# Altium project Carrier-Board-v1.0.PrjPcb (part 8 of 15)

## Sheet ETHERNET_PHY1.SchDoc
size 420 x 297 mm; SheetNumber: 14; SheetTotal: 27
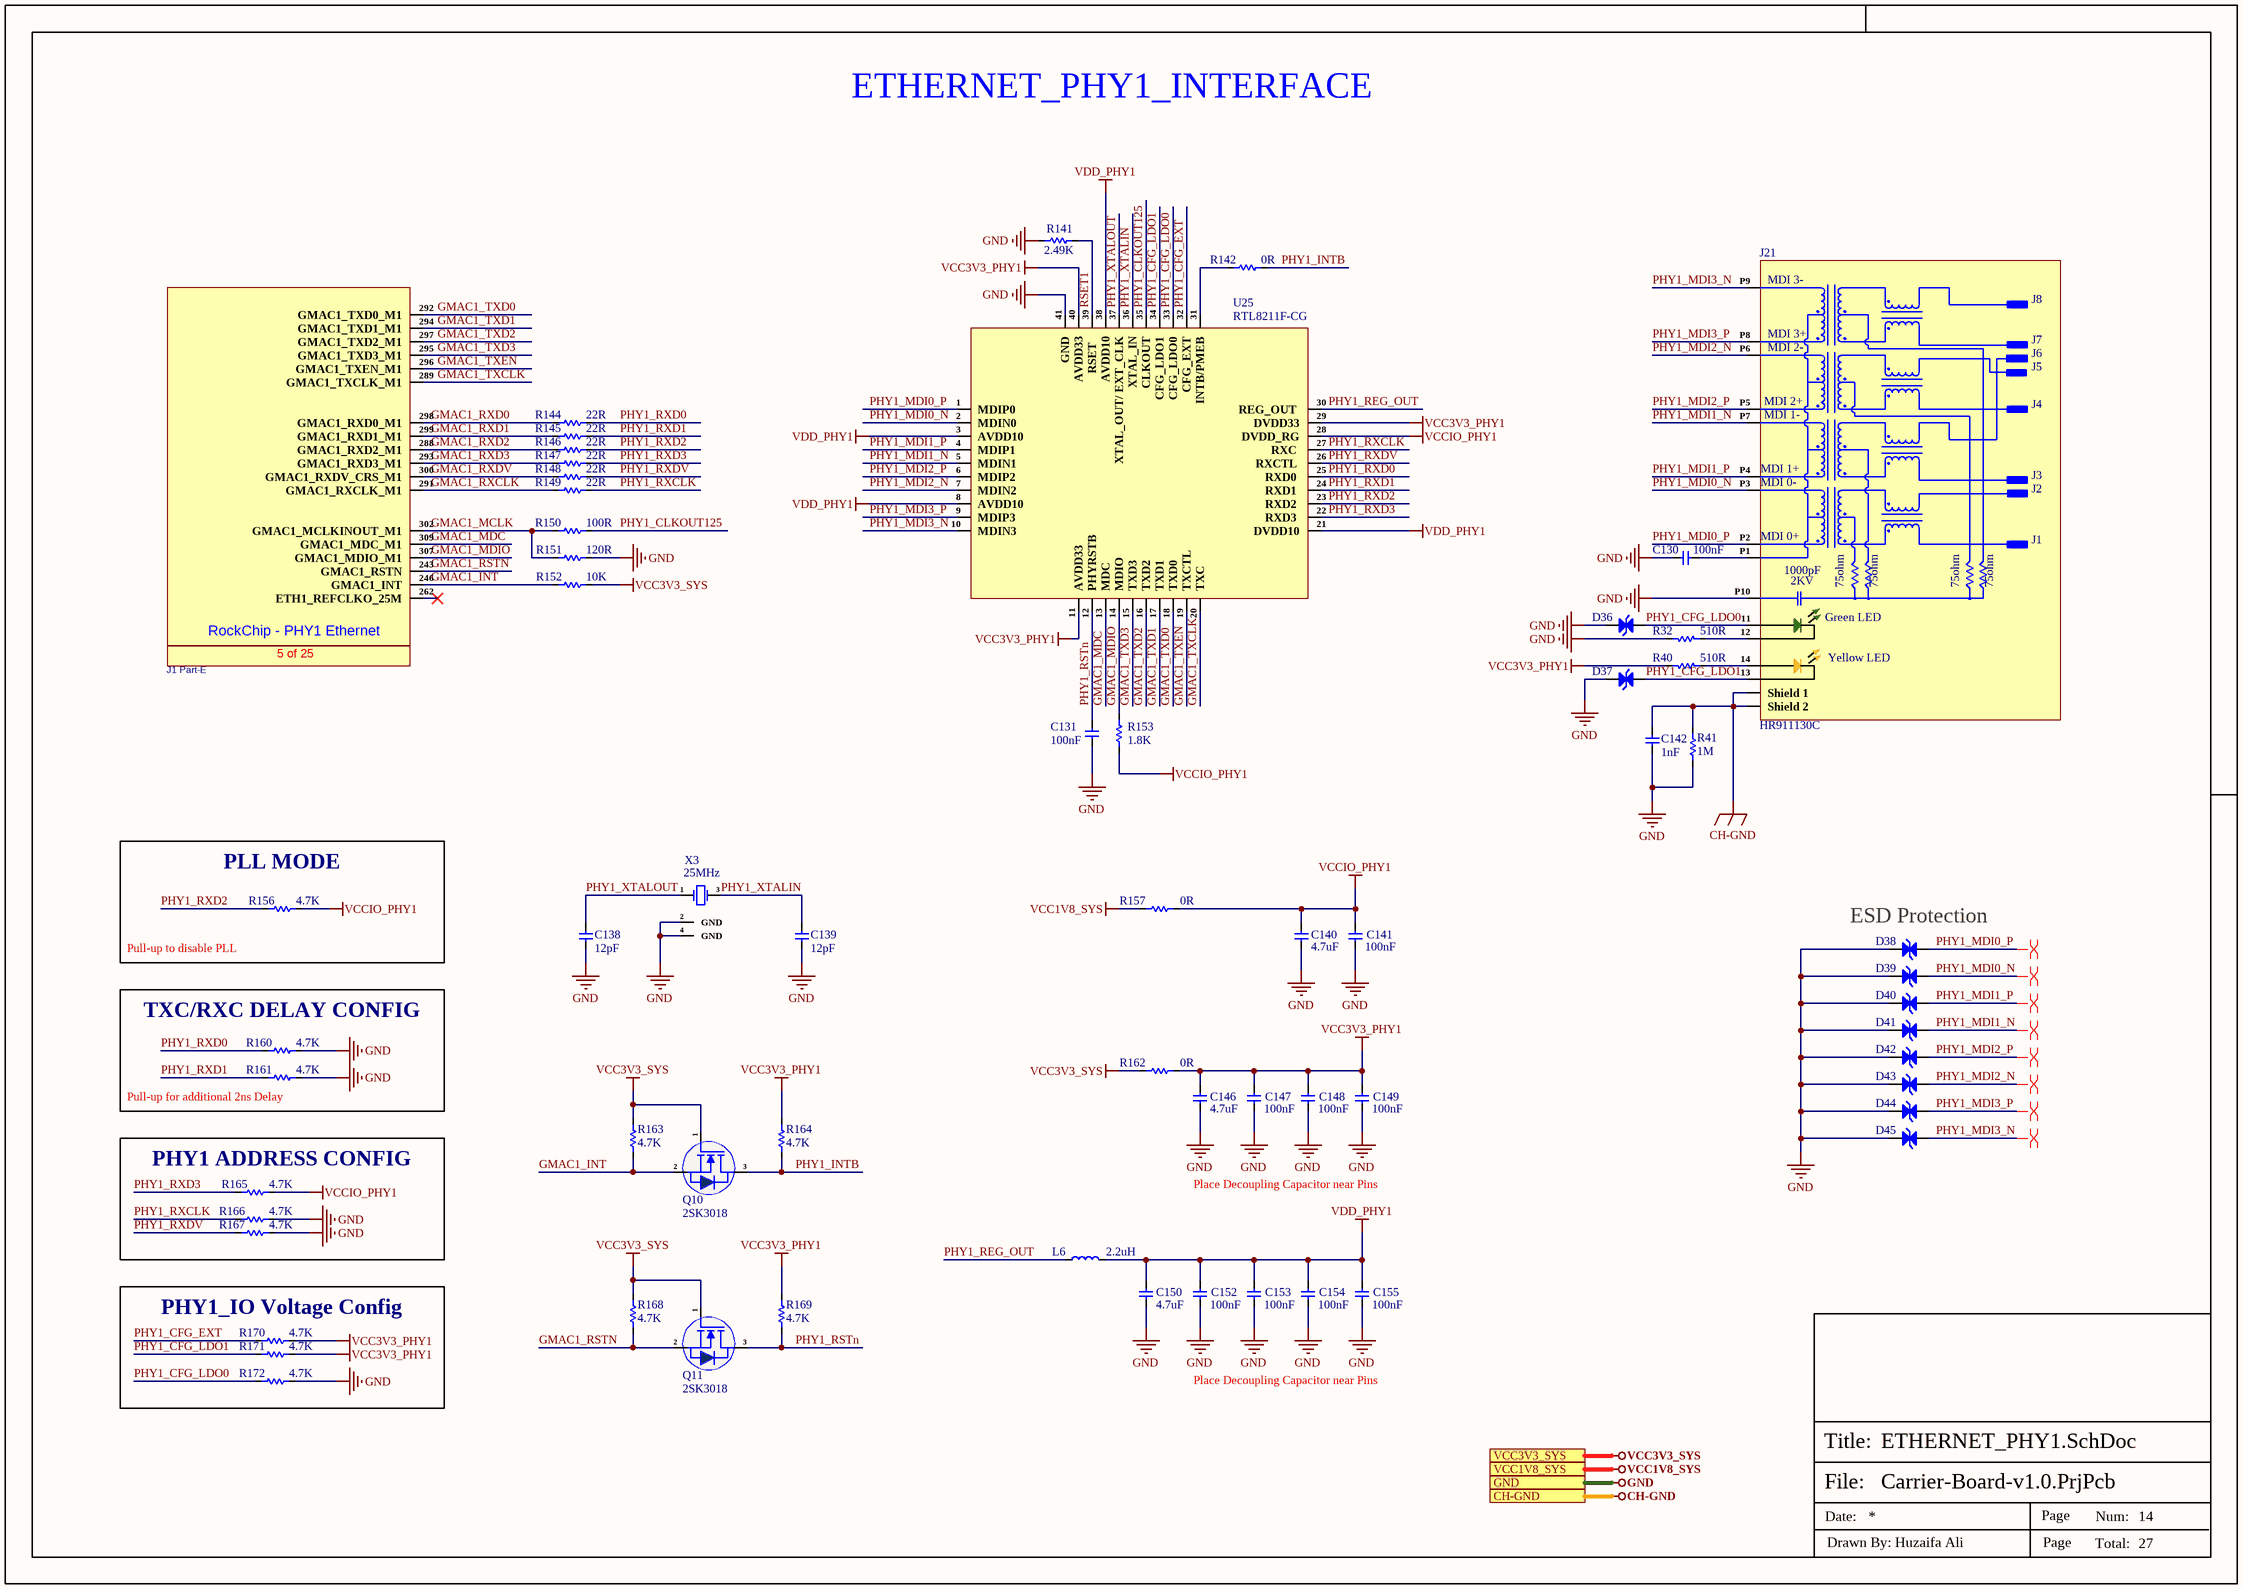
[diagram p13: ETHERNET_PHY1.SchDoc]

### Parts
C130  100nF  [cap-0402]
C131  100nF  [Cap-0402]
C138  12pF  [Cap-0402]
C139  12pF  [Cap-0402]
C140  4.7uF  [Cap-0402]
C141  100nF  [Cap-0402]
C142  1nF  [Cap-1206]
C146  4.7uF  [Cap-0402]
C147  100nF  [Cap-0402]
C148  100nF  [Cap-0402]
C149  100nF  [Cap-0402]
C150  4.7uF  [Cap-0402]
C152  100nF  [Cap-0402]
C153  100nF  [Cap-0402]
C154  100nF  [Cap-0402]
C155  100nF  [Cap-0402]
D36  ESD9X5VU  [DFN1006-2L_]  (value not drawn)
D37  ESD9X5VU  [DFN1006-2L_]  (value not drawn)
D38  ESD9X5VU  [DFN1006-2L_]  (value not drawn)
D39  ESD9X5VU  [DFN1006-2L_]  (value not drawn)
D40  ESD9X5VU  [DFN1006-2L_]  (value not drawn)
D41  ESD9X5VU  [DFN1006-2L_]  (value not drawn)
D42  ESD9X5VU  [DFN1006-2L_]  (value not drawn)
D43  ESD9X5VU  [DFN1006-2L_]  (value not drawn)
D44  ESD9X5VU  [DFN1006-2L_]  (value not drawn)
D45  ESD9X5VU  [DFN1006-2L_]  (value not drawn)
J1_Part-  AS0B826-S78B-7H  [AS0B826-S78B-7H]  (value not drawn)  (part E of 25)
J21  HR911130C  [HR911130C]
L6  2.2uH  [MAKK2016T2R2M_]
Q10  2SK3018  [SOT-23]
Q11  2SK3018  [SOT-23]
R32  510R  [Res-0402]
R40  510R  [Res-0402]
R41  1M  [Res-0402]
R141  2.49K  [Res-0402]
R142  0R  [Res-0402]
R144  22R  [Res-0402]
R145  22R  [Res-0402]
R146  22R  [Res-0402]
R147  22R  [Res-0402]
R148  22R  [Res-0402]
R149  22R  [Res-0402]
R150  100R  [Res-0402]
R151  120R  [Res-0402]
R152  10K  [Res-0402]
R153  1.8K  [Res-0402]
R156  4.7K  [Res-0402]
R157  0R  [Res-0603]
R160  4.7K  [Res-0402]
R161  4.7K  [Res-0402]
R162  0R  [Res-0603]
R163  4.7K  [Res-0402]
R164  4.7K  [Res-0402]
R165  4.7K  [Res-0402]
R166  4.7K  [Res-0402]
R167  4.7K  [Res-0402]
R168  4.7K  [Res-0402]
R169  4.7K  [Res-0402]
R170  4.7K  [Res-0402]
R171  4.7K  [Res-0402]
R172  4.7K  [Res-0402]
U25  RTL8211F-CG  [WQFN-40-EP(5x5)]
X3  25MHz  [Q22FA12800090]

### Blocks framed on the sheet
PLL MODE: R156
TXC/RXC DELAY CONFIG: R160 R161
PHY1 ADDRESS CONFIG: R165-R167
PHY1_IO Voltage Config: R170-R172

### Ports
CH-GND (see TOP SHEET[3B], ETHERNET_PHY0[4D], HDMI_INTERFACE[3D], MICRO_SD_INTERFACE[3D], USB2.0_INTERFACE[3D], USB3.0_INTERFACE[3D], USB-C_INTERFACE[2D]), GND (see TOP SHEET[3B], AUDIO_INTERFACE[1D], BUCK REGULATOR[3D], DEBUG_UART_INTERFACE[3D], DIGITAL IO_RELAY_SHEET[5D], DUAL_SIM_INTERFACE[3D], ETHERNET_PHY0[4D], GSM_INTERFACE[2D], HDMI_INTERFACE[3D], INPUT_PROTECTION[3D], LINEAR_VOLTAGE_REG[3D], MICRO_SD_INTERFACE[3D], MIPI-DSI DISPLAY[3D], POWER SECTION[3D], PUSH BUTTONs_INTERFACE[3C], RGB_LEDs_INTERFACE[3D], ROCKCHIP_PWR_SUPPLY[1D], ROCKCHIP_SYSTEM_CONTROL[3C], RS232_RS485_INTERFACE[3C], SENSOR_SHEET[3D], USB2.0_INTERFACE[3D], USB3.0_INTERFACE[3D], USB-C_INTERFACE[2D], WIEGAND_INTERFACE[3D], WIFI_BLUETOOTH_SHEET[4C]), VCC1V8_SYS (see TOP SHEET[3B], ETHERNET_PHY0[4D], LINEAR_VOLTAGE_REG[3D], POWER SECTION[3D], ROCKCHIP_PWR_SUPPLY[1D], WIFI_BLUETOOTH_SHEET[4C]), VCC3V3_SYS (see TOP SHEET[3B], AUDIO_INTERFACE[1D], BUCK REGULATOR[3D], DEBUG_UART_INTERFACE[3D], DIGITAL IO_RELAY_SHEET[5D], ETHERNET_PHY0[4D], GSM_INTERFACE[2D], HDMI_INTERFACE[3D], LINEAR_VOLTAGE_REG[3D], MIPI-DSI DISPLAY[3D], POWER SECTION[3D], PUSH BUTTONs_INTERFACE[3C], ROCKCHIP_PWR_SUPPLY[1D], ROCKCHIP_SYSTEM_CONTROL[3C], RS232_RS485_INTERFACE[3C], SENSOR_SHEET[3D], USB-C_INTERFACE[2D], WIEGAND_INTERFACE[3D], WIFI_BLUETOOTH_SHEET[4C])

### Nets
CH-GND: C142.2 J21.SH1(Shield_1) J21.SH2(Shield_2) R41.2 ; port CH-GND
GND: C130.1 C131.1 C138.1 C139.1 C140.1 C141.1 C142.1 C146.1 C147.1 C148.1 C149.1 C150.1 C152.1 C153.1 C154.1 C155.1 D36.1(A) D37.1(A) D38.1(A) D39.1(A) D40.1(A) D41.1(A) D42.1(A) D43.1(A) D44.1(A) D45.1(A) J21.P10 R32.2 R41.1 R141.1 R151.1 R160.2 R161.2 R166.2 R167.2 R172.2 U25.41(GND) X3.2(GND) X3.4(GND) ; port GND
VCC1V8_SYS: R157.1 ; port VCC1V8_SYS
VCC3V3_PHY1: C146.2 C147.2 C148.2 C149.2 R40.1 R162.2 R164.2 R169.2 R170.2 R171.2 U25.11(AVDD33) U25.29(DVDD33) U25.40(AVDD33)
VCC3V3_SYS: Q10.1(G) Q11.1(G) R152.1 R162.1 R163.2 R168.2 ; port VCC3V3_SYS
VCCIO_PHY1: C140.2 C141.2 R153.2 R156.2 R157.2 R165.2 U25.28(DVDD_RG)
VDD_PHY1: C150.2 C152.2 C153.2 C154.2 C155.2 L6.2 U25.3(AVDD10) U25.8(AVDD10) U25.21(DVDD10) U25.38(AVDD10)
GMAC1_INT: J1_Part-.246(GMAC1_INT) Q10.2(S) R152.2 R163.1
GMAC1_MCLK: J1_Part-.302(GMAC1_MCLKINOUT_M1) R150.1 R151.2
GMAC1_MDC: J1_Part-.309(GMAC1_MDC_M1) U25.13(MDC)
GMAC1_MDIO: J1_Part-.307(GMAC1_MDIO_M1) R153.1 U25.14(MDIO)
GMAC1_RSTN: J1_Part-.243(GMAC1_RSTN) Q11.2(S) R168.1
GMAC1_RXCLK: J1_Part-.291(GMAC1_RXCLK_M1) R149.1
GMAC1_RXD0: J1_Part-.298(GMAC1_RXD0_M1) R144.1
GMAC1_RXD1: J1_Part-.299(GMAC1_RXD1_M1) R145.1
GMAC1_RXD2: J1_Part-.288(GMAC1_RXD2_M1) R146.1
GMAC1_RXD3: J1_Part-.293(GMAC1_RXD3_M1) R147.1
GMAC1_RXDV: J1_Part-.300(GMAC1_RXDV_CRS_M1) R148.1
GMAC1_TXCLK: J1_Part-.289(GMAC1_TXCLK_M1) U25.20(TXC)
GMAC1_TXD0: J1_Part-.292(GMAC1_TXD0_M1) U25.18(TXD0)
GMAC1_TXD1: J1_Part-.294(GMAC1_TXD1_M1) U25.17(TXD1)
GMAC1_TXD2: J1_Part-.297(GMAC1_TXD2_M1) U25.16(TXD2)
GMAC1_TXD3: J1_Part-.295(GMAC1_TXD3_M1) U25.15(TXD3)
GMAC1_TXEN: J1_Part-.296(GMAC1_TXEN_M1) U25.19(TXCTL)
PHY1_CFG_EXT: R170.1 U25.32(CFG_EXT)
PHY1_CFG_LDO0: D36.2(A) J21.11 R172.1 U25.33(CFG_LDO0)
PHY1_CFG_LDO1: D37.2(A) J21.13 R171.1 U25.34(CFG_LDO1)
PHY1_CLKOUT125: R150.2 U25.35(CLKOUT)
PHY1_INTB: Q10.3(D) R142.2 R164.1
PHY1_MDI0_N: D39.2(A) J21.P3(P4) U25.2(MDIN0)
PHY1_MDI0_P: D38.2(A) J21.P2 U25.1(MDIP0)
PHY1_MDI1_N: D41.2(A) J21.P7 U25.5(MDIN1)
PHY1_MDI1_P: D40.2(A) J21.P4 U25.4(MDIP1)
PHY1_MDI2_N: D43.2(A) J21.P6 U25.7(MDIN2)
PHY1_MDI2_P: D42.2(A) J21.P5 U25.6(MDIP2)
PHY1_MDI3_N: D45.2(A) J21.P9 U25.10(MDIN3)
PHY1_MDI3_P: D44.2(A) J21.P8 U25.9(MDIP3)
PHY1_REG_OUT: L6.1 U25.30(REG_OUT)
PHY1_RSTn: C131.2 Q11.3(D) R169.1 U25.12(PHYRSTB)
PHY1_RXCLK: R149.2 R166.1 U25.27(RXC)
PHY1_RXD0: R144.2 R160.1 U25.25(RXD0)
PHY1_RXD1: R145.2 R161.1 U25.24(RXD1)
PHY1_RXD2: R146.2 R156.1 U25.23(RXD2)
PHY1_RXD3: R147.2 R165.1 U25.22(RXD3)
PHY1_RXDV: R148.2 R167.1 U25.26(RXCTL)
PHY1_XTALIN: C139.2 U25.36(XTAL_IN) X3.3(OSC2)
PHY1_XTALOUT: C138.2 U25.37(XTAL_OUT/_EXT_CLK) X3.1(OSC1)
RSET1: R141.2 U25.39(RSET)
NetC130_2: C130.2 J21.P1
NetJ21_12: J21.12 R32.1
NetJ21_14: J21.14 R40.2
NetR142_1: R142.1 U25.31(INTB/PMEB)

Not connected (* = marked no-connect by the designer): J1_Part- 262(ETH1_REFCLKO_25M)*

### Layout directives
differential pair; differential pair class DIFF-ETH-100; rule Impedance Constraint [Min = 100.0    Max = 110.0    ]; rule Matched Net Lengths [Tolerance = 0.508mm]: PHY1_MDI0_N, PHY1_MDI0_P, PHY1_MDI1_N, PHY1_MDI1_P, PHY1_MDI2_N, PHY1_MDI2_P, PHY1_MDI3_N, PHY1_MDI3_P

### Notes on the sheet
- ETHERNET_PHY1_INTERFACE
- (near D38) ESD Protection
- (near R156) Pull-up to disable PLL
- (near R161) Pull-up for additional 2ns Delay
- Place Decoupling Capacitor near Pins
- File:
- Title:
- Date:
- Page
- Num:
- Total:
- Drawn By: Huzaifa Ali
- (in symbol AS0B826-S78B-7H, part E) RockChip - PHY1 Ethernet; 5 of 25
- (in symbol HR911130C) MDI 3-; J8; MDI 3+; J7; MDI 2-; J6; J5; MDI 2+; J4; MDI 1-; MDI 1+; J3; MDI 0-; J2; MDI 0+; J1; 1000pF; 2KV; 75ohm; Green LED; Yellow LED

### Library data of the parts
C130 = C1005X7R1H104KT000F: CAP CER 0.1UF 50V X7R 0402; Manufacturer: TDK; Tolerance: 10%; Voltage: 25V; Item Type: Capacitor; Supplier 1: Avnet; Manufacturer Part Number: C1005X7R1H104KT000F; RoHS: No; Category: Ceramic Capacitors; Dielectric: X7R; ComponentLink1URL: https://www.lcsc.com/product-detail/Multilayer-Ceramic-Capacitors-MLCC-SMD-SMT_TDK-C1005X7R1H104KT000F_C361198.html; ComponentLink1Description: LCSC; Supplier Part Number 1: C1005X7R1H104KT000F; LCSC Part Number: C361198
C131 C141 C147-C149 C152-C155 = CC0402KRX5R7BB104: CAP CER 0.1UF 16V X5R 0402; Manufacturer: Yageo; Tolerance: 10%; Supplier 1: Mouser; Manufacturer Part Number: CC0402KRX5R7BB104; RoHS: Yes; Category: Ceramic Capacitors; Stock 1: 936792; Pricing 1: 1=0.10000, 10=0.02300, 50=0.02300, 100=0.01100, 1000=0.00600, 10000=0.00400 (USD); Mount: Surface Mount; Case/Package: 0402; Case Code (Imperial): 0402; Case Code (Metric): 1005; Min Operating Temperature: -55°C; Max Operating Temperature: 85°C; Capacitance: 100nF; Packaging: Tape and Reel; Voltage Rating: 16V; Dielectric: X5R; Termination: SMD/SMT; Voltage Rating (DC): 16V; Package Quantity: 1; Length: 1mm; Width: 0.02inch; Thickness: 0.022inch; Lead Free: Lead Free; Halogen Free: Halogen Free; ComponentLink1URL: https://datasheet.ciiva.com/155/mlccorderingcode-155879.pdf?src-supplier=Digi-Key; ComponentLink1Description: https://datasheet.ciiva.com/155/mlccorderingcode-155879.pdf?src-supplier=Digi-Key; ComponentLink2URL: https://datasheet.ciiva.com/155/mlccorderingcode-155878.pdf?src-supplier=Digi-Key; ComponentLink2Description: https://datasheet.ciiva.com/155/mlccorderingcode-155878.pdf?src-supplier=Digi-Key; ComponentLink3URL: https://datasheet.ciiva.com/155/mlccorderingcode-155880.pdf?src-supplier=Digi-Key; ComponentLink3Description: https://datasheet.ciiva.com/155/mlccorderingcode-155880.pdf?src-supplier=Digi-Key; Supplier Part Number 1: 603-CC402KRX5R7BB104; LCSC Part Number: C106204; Number of Pins: 2; Resistor Type: Ceramic; Series: CC; Construction: Flat; Height: 0.5mm; Depth: 0.5mm; Radiation Hardening: No; REACH SVHC: Unknown; RoHS Compliant: Yes; ComponentLink4URL: https://datasheet.ciiva.com/11464/upy-gphc-x5r-4v-to-50v-12-11464869.pdf?src-supplier=Avnet; ComponentLink4Description: https://datasheet.ciiva.com/11464/upy-gphc-x5r-4v-to-50v-12-11464869.pdf?src-supplier=Avnet
C138 C139 = GJM1555C1H120GB01D: CAP CER 12PF 50V C0G/NP0 0402; Manufacturer: Murata; Tolerance: 2%; Dielectric: C0G; Supplier 1: Digi-Key; Manufacturer Part Number: GJM1555C1H120GB01D; RoHS: Yes; Category: Ceramic Capacitors; Stock 1: 266975; Pricing 1: 1=0.18000, 10=0.12600, 50=0.07560, 100=0.06390, 500=0.04370, 1000=0.03865, 2500=0.03698, 5000=0.03361 (USD); Mount: Surface Mount; Case/Package: 0402; Case Code (Imperial): 0402; Case Code (Metric): 1005; Min Operating Temperature: -55°C; Max Operating Temperature: 125°C; Capacitance: 12pF; Voltage Rating: 50V; Voltage Rating (DC): 50V; Packaging: Tape and Reel; Package Quantity: 10000; Termination: SMD/SMT; Series: GJM; Construction: Flat; Length: 1mm; Width: 0.5mm; Height: 0.5mm; Thickness: 0.022inch; Depth: 0.5mm; Radiation Hardening: No; Lead Free: Lead Free; RoHS Compliant: Yes; ComponentLink1URL: https://datasheet.ciiva.com/11608/product-11608208.pdf?src-supplier=Avnet; ComponentLink1Description: https://datasheet.ciiva.com/11608/product-11608208.pdf?src-supplier=Avnet; ComponentLink2URL: https://datasheet.ciiva.com/29542/partnumbering-e-01-29542716.pdf?src-supplier=Digi-Key; ComponentLink2Description: https://datasheet.ciiva.com/29542/partnumbering-e-01-29542716.pdf?src-supplier=Digi-Key; ComponentLink3URL: https://datasheet.ciiva.com/29542/partnumbering-e-01-29542715.pdf?src-supplier=Digi-Key; ComponentLink3Description: https://datasheet.ciiva.com/29542/partnumbering-e-01-29542715.pdf?src-supplier=Digi-Key; ComponentLink4URL: https://datasheet.ciiva.com/29542/partnumbering-e-01-29542717.pdf?src-supplier=Digi-Key; ComponentLink4Description: https://datasheet.ciiva.com/29542/partnumbering-e-01-29542717.pdf?src-supplier=Digi-Key; Supplier Part Number 1: 490-8078-1-ND; LCSC Part Number: C161305
C140 C146 C150 = CC0402KRX5R6BB475: CAP CER 4.7UF 10V X5R 0402; Manufacturer: Yageo; Tolerance: 10%; Supplier 1: Farnell; Manufacturer Part Number: CC0402KRX5R6BB475; RoHS: Yes; Category: Ceramic Capacitors; Stock 1: 20000; Pricing 1: 10000=0.02310, 50000=0.02100 (GBP); Mount: Surface Mount; Case/Package: 0402; Case Code (Imperial): 0402; Case Code (Metric): 1005; Min Operating Temperature: -55°C; Max Operating Temperature: 85°C; Packaging: Cut Tape; Capacitance: 4.7uF; Voltage Rating: 10V; RoHS Compliant: Yes; ComponentLink1URL: http://www.yageo.com/documents/recent/UPY-GPHC_X5R_4V-to-50V_25.pdf?src-supplier=Digi-Key; ComponentLink1Description: http://www.yageo.com/documents/recent/UPY-GPHC_X5R_4V-to-50V_25.pdf?src-supplier=Digi-Key; Supplier Part Number 1: 3871698; LCSC Part Number: C326586
C142 = CC1206KKX7RDBB102: CAP CER 1000PF 2KV X7R 1206; Manufacturer: Yageo; Tolerance: 10%; Dissipation Factor: 2.5%; Insulation Resistance: 10GR; Item Type: Capacitor; Manufacturer Part Number: CC1206KKX7RDBB102; RoHS: Yes; Category: Ceramic Capacitors; Case/Package: 1206; Case Code (Metric): 3216; Case Code (Imperial): 1206; Min Operating Temperature: -55°C; Max Operating Temperature: 125°C; Voltage Rating: 2kV; Packaging: Tape and Reel; Dielectric: X7R; Termination: SMD/SMT; Voltage Rating (DC): 2kV; Series: CC; Construction: Flat; Length: 3.2mm; RoHS Compliant: Yes; ComponentLink1URL: https://datasheet.ciiva.com/23942/1449957-23942422.pdf?src-supplier=Newark; ComponentLink1Description: https://datasheet.ciiva.com/23942/1449957-23942422.pdf?src-supplier=Newark; ComponentLink2URL: https://datasheet.ciiva.com/186/upy-np0x7r-hv-1kv-to-3kv-4-186736.pdf?src-supplier=Digi-Key; ComponentLink2Description: https://datasheet.ciiva.com/186/upy-np0x7r-hv-1kv-to-3kv-4-186736.pdf?src-supplier=Digi-Key; ComponentLink3URL: https://datasheet.ciiva.com/186/upy-np0x7r-hv-1kv-to-3kv-4-186737.pdf?src-supplier=Digi-Key; ComponentLink3Description: https://datasheet.ciiva.com/186/upy-np0x7r-hv-1kv-to-3kv-4-186737.pdf?src-supplier=Digi-Key; ComponentLink4URL: https://datasheet.ciiva.com/13386/upy-gp-np0-16v-to-50v-8-13386312.pdf?src-supplier=Mouser; ComponentLink4Description: https://datasheet.ciiva.com/13386/upy-gp-np0-16v-to-50v-8-13386312.pdf?src-supplier=Mouser; ComponentLink5URL: https://datasheet.ciiva.com/186/upy-np0x7r-hv-1kv-to-3kv-4-186735.pdf?src-supplier=Digi-Key; ComponentLink5Description: https://datasheet.ciiva.com/186/upy-np0x7r-hv-1kv-to-3kv-4-186735.pdf?src-supplier=Digi-Key; Supplier 1: Digi-Key; Stock 1: 19260; Pricing 1: 1=0.35000, 10=0.24000, 50=0.16780, 100=0.14390, 500=0.10794, 1000=0.09114 (USD); Mount: Surface Mount; Number of Pins: 2; Capacitance: 1nF; Voltage: 2kV; Package Quantity: 1; Resistor Type: Ceramic; Width: 0.063inch; Height: 1.25mm; Depth: 1.6mm; Thickness: 0.057inch; Radiation Hardening: No; REACH SVHC: Unknown; Lead Free: Lead Free; Supplier Part Number 1: 311-1487-1-ND; LCSC Part Number: C23631
D36-D45 = ESD9X5VU: DFN1006-2 ESD Protection Devices ROHS; Manufacturer: TECH PUBLIC; Manufacturer Part Number: ESD9X5VU; Footprint: DFN1006-2; ComponentLink1Description: LCSC; ComponentLink1URL: https://www.lcsc.com/product-detail/span-style-background-color-ff0-ESD-span-Protection-Devices_TECH-PUBLIC-ESD9X5VU_C2875160.html; LCSC Part Number: C2875160
J1_Part- = AS0B826-S78B-7H: SMD,P=0.5mm,Surface Mount，Right Angle; Manufacturer: FOXCONN; Item Type: Card Edge Connectors; Supplier: LCSC; Manufacturer Part Number: AS0B826-S78B-7H; RoHS: No; Stock: 4979; Pricing: 1=9.21, 10=8.287, 25=7.8064, 50=7.6064, 100=7.4062 (USD); LCSC Part Number: C426232
J21 = HR911130C: RJ45 RJReceptacle 1 Internal oscillator included Shrouded WithLED Plugin Ethernet Connectors/Modular Connectors (RJ45 RJ11) ROHS; Manufacturer: HANRUN; Manufacturer Part Number: HR911130C; LCSC Part Number: C50933; Item Type: Ethernet Connector; ComponentLink1Description: LCSC; ComponentLink1URL: https://www.lcsc.com/product-detail/Ethernet-Connectors-Modular-Connectors-RJ45-RJ11_HANRUN-Zhongshan-HanRun-Elec-HR911130C_C50933.html
L6 = MAKK2016T2R2M: FIXED IND 2.2UH 1.5A 160MOHM SMD; Manufacturer: Taiyo Yuden; Core Material: Metal; Tolerance: 20%; Shielding: Shielded; DC Resistance (DCR): 160mR; Test Frequency: 2MHz; Item Type: Inductor; Supplier 1: Mouser; Manufacturer Part Number: MAKK2016T2R2M; RoHS: Yes; Category: Fixed Inductors; Stock 1: 64320; Pricing 1: 1=0.27000, 10=0.17200, 50=0.17200, 100=0.14000, 1000=0.10600, 10000=0.09200 (USD); Mount: Surface Mount; Case/Package: 0806; Case Code (Metric): 2016; Case Code (Imperial): 0806; Min Operating Temperature: -40°C; Max Operating Temperature: 105°C; Packaging: Tape and Reel; Package Quantity: 3000; Resistor Type: Wirewound; Inductance: 2.2uH; Current Rating: 1.5A; Saturation Current: 1.5A; Max DC Current: 1.5A; Termination: SMD/SMT; Length: 0.079inch; Width: 0.063inch; Height: 1mm; Height - Seated (Max): 0.039inch; Depth: 1.6mm; Radiation Hardening: No; Halogen Free: Halogen Free; RoHS Compliant: Yes; ComponentLink1URL: https://datasheet.ciiva.com/30014/makk2016t2r2m-ss-30014449.pdf?src-supplier=Avnet; ComponentLink1Description: https://datasheet.ciiva.com/30014/makk2016t2r2m-ss-30014449.pdf?src-supplier=Avnet; Supplier Part Number 1: 963-MAKK2016T2R2M; LCSC Part Number: C92923
Q10 Q11 = 2SK3018: 30V 100mA 200mW 8Ω@4V,10mA N Channel SOT-23 MOSFETs ROHS; Manufacturer: KUU; Item Type: MOSFET; Manufacturer Part Number: 2SK3018; Package: SOT-23; LCSC Part Number: C2944164; ComponentLink1Description: LCSC; ComponentLink1URL: https://www.lcsc.com/product-detail/MOSFETs_KUU-2SK3018_C2944164.html
R32 R40 = RT0402FRE07510RL: RES SMD 510 OHM 1% 1/16W 0402; Manufacturer: Yageo; Max Power Dissipation: 63mW; Temperature Coefficient: 50ppm/°C; Voltage Rating (DC): 50V; Item Type: Resistor; Supplier: Digikey; Supplier Part Number: 13-RT0402FRE07510RLCT-ND; Manufacturer Part Number: RT0402FRE07510RL; RoHS: Yes; Category: Chip SMD Resistors; Stock: 19529; Pricing: 1=0.1, 10=0.027, 50=0.0224, 100=0.0203, 500=0.0161, 1000=0.01443, 5000=0.01101 (USD); Case/Package: 0402; Min Operating Temperature: -55°C; Max Operating Temperature: 125°C; Package Quantity: 10000; Packaging: Tape and Reel; Value: 510R; Tolerance: 1%; Number of Terminations: 2; Series: RT; Length: 0.039inch; Width: 0.02inch; Height: 0.014inch; Lead Free: Lead Free; RoHS Compliant: Yes; ComponentLink1URL: https://datasheet.ciiva.com/2561/pyu-rt-1-to-0-05-rohs-l-5-2561767.pdf?src-supplier=Digikey; ComponentLink1Description: https://datasheet.ciiva.com/2561/pyu-rt-1-to-0-05-rohs-l-5-2561767.pdf?src-supplier=Digikey; LCSC Part Number: C854355
R41 = AF0402JR-071ML: RES SMD 1M OHM 5% 1/16W 0402; Manufacturer: Yageo; Temperature Coefficient: 100ppm/°C; Resistance: 1MR; Item Type: Resistor; Max Power Dissipation: 63mW; Manufacturer Part Number: AF0402JR-071ML; Case/Package: 0402; Min Operating Temperature: -55°C; Max Operating Temperature: 155°C; Packaging: Tape and Reel; Tolerance: 5%; Height: 0.015inch; ComponentLink1URL: https://www.yageo.com/upload/media/product/productsearch/datasheet/rchip/PYu-AF_51_RoHS_L_6.pdf?src-supplier=Digi-Key; ComponentLink1Description: https://www.yageo.com/upload/media/product/productsearch/datasheet/rchip/PYu-AF_51_RoHS_L_6.pdf?src-supplier=Digi-Key; Supplier 1: Digi-Key; Stock 1: 0; Pricing 1: 10000=0.00408 (USD); Length: 0.039inch; Width: 0.02inch; Supplier Part Number 1: AF0402JR-071ML-ND; LCSC Part Number: C144054; Resistor Type: Thick Film; Number of Terminations: 2; Features: Moisture Resistant,Anti-Sulfur; RoHS Compliant: Yes
R141 = RC0402FR-072K49L: RES 2.49K OHM 1% 1/16W 0402; Manufacturer: Yageo; Power Rating: 62.5mW; Temperature Coefficient: 100ppm/°C; Value: 2.49kR; Voltage Rating: 50V; Max Power Dissipation: 63mW; Item Type: Resistors; Manufacturer Part Number: RC0402FR-072K49L; RoHS: Yes; Case Code (Imperial): 0402; Case Code (Metric): 1005; Case/Package: 0402; Min Operating Temperature: -55°C; Max Operating Temperature: 155°C; Tolerance: 1%; Series: RC; Packaging: Tape and Reel; Termination: SMD/SMT; Resistor Type: Thick Film; Features: Moisture Resistant; Number of Terminations: 2; Resistance Tolerance: 1%; Voltage Rating (DC): 50V; Length: 0.039inch; Width: 0.02inch; Height: 0.016inch; RoHS Compliant: Yes; Reach SVHC Compliant: No; Lead Free: Lead Free; ComponentLink1URL: https://datasheet.ciiva.com/2518/pyu-r-int-thick-7-2518986.pdf?src-supplier=Digikey; ComponentLink1Description: https://datasheet.ciiva.com/2518/pyu-r-int-thick-7-2518986.pdf?src-supplier=Digikey; LCSC Part Number: C145071; Package Quantity: 1; ComponentLink2URL: https://datasheet.ciiva.com/2518/pyu-r-int-thick-7-2518987.pdf?src-supplier=Digikey; ComponentLink2Description: https://datasheet.ciiva.com/2518/pyu-r-int-thick-7-2518987.pdf?src-supplier=Digikey; ComponentLink3URL: https://datasheet.ciiva.com/7983/1018594-7983516.pdf?src-supplier=Element14; ComponentLink3Description: https://datasheet.ciiva.com/7983/1018594-7983516.pdf?src-supplier=Element14; ComponentLink4URL: https://datasheet.ciiva.com/2518/pyu-r-int-thick-7-2518985.pdf?src-supplier=Digikey; ComponentLink4Description: https://datasheet.ciiva.com/2518/pyu-r-int-thick-7-2518985.pdf?src-supplier=Digikey; ComponentLink5URL: https://datasheet.ciiva.com/5558/pyu-rc0402-51-rohs-l-6-r-5558122.pdf?src-supplier=Mouser; ComponentLink5Description: https://datasheet.ciiva.com/5558/pyu-rc0402-51-rohs-l-6-r-5558122.pdf?src-supplier=Mouser; Supplier: Future Electronics; Supplier Part Number: 7635139; Stock: 530000; Pricing: 10000=0.0012, 100000=0.0011, 300000=0.001, 750000=0.001, 2000000=0.0009 (USD); Contact Plating: Tin,Lead
R142 = RC0402FR-070RL: RES 0 OHM JUMPER 1/16W 0402; Manufacturer: Yageo; Power Rating: 62.5mW; Tolerance: 1%; Voltage Rating: 50V; Temperature Coefficient: 200ppm/°C; Max Power Dissipation: 63mW; Supplier 1: Mouser; Manufacturer Part Number: RC0402FR-070RL; RoHS: Yes; Category: Chip SMD Resistors; Stock 1: 8556842; Pricing 1: 1=0.10000, 10=0.01400, 50=0.01400, 100=0.00600, 1000=0.00300, 5000=0.00200, 10000=0.00100 (USD); Case/Package: 0402; Case Code (Imperial): 0402; Case Code (Metric): 1005; Size Code: 0402; Min Operating Temperature: -55°C; Max Operating Temperature: 155°C; Resistor Type: Thick Film; Resistance: 0R; Packaging: Tape and Reel; Termination: SMD/SMT; Features: Moisture Resistant; Series: RC; Number of Terminations: 2; Length: 1mm; Width: 0.5mm; Height: 0.35mm; RoHS Compliant: Yes; Lead Free: Lead Free; ComponentLink1URL: https://datasheet.ciiva.com/8896/pyu-rc0402-51-rohs-l-6-8896149.pdf?src-supplier=Avnet; ComponentLink1Description: https://datasheet.ciiva.com/8896/pyu-rc0402-51-rohs-l-6-8896149.pdf?src-supplier=Avnet; ComponentLink2URL: https://datasheet.ciiva.com/16790/pyu-rc0402-51-rohs-l-6-r-16790444.pdf?src-supplier=Future+Electronics; ComponentLink2Description: https://datasheet.ciiva.com/16790/pyu-rc0402-51-rohs-l-6-r-16790444.pdf?src-supplier=Future+Electronics; Supplier Part Number 1: 603-RC0402FR-070RL; LCSC Part Number: C106231; Mount: Surface Mount; Contact Plating: Tin,Matte; Radiation Hardening: No
R144-R149 = RC0402FR-0722RL: RES 22 OHM 1% 1/16W 0402; Manufacturer: Yageo; Voltage Rating: 50V; Power Rating: 62.5mW; Temperature Coefficient: 100ppm/°C; Max Power Dissipation: 63mW; Item Type: Resistor; Supplier 1: Avnet; Manufacturer Part Number: RC0402FR-0722RL; RoHS: Yes; Category: Chip SMD Resistors; Stock 1: 1810000; Pricing 1: 10000=0.00085 (USD); Case/Package: 0402; Number of Pins: 2; Case Code (Imperial): 0402; Case Code (Metric): 1005; Size Code: 0402; Min Operating Temperature: -55°C; Max Operating Temperature: 155°C; Resistor Type: Thick Film; Voltage Rating (DC): 50V; Resistance: 22R; Tolerance: 1%; Packaging: Tape and Reel; Termination: SMD/SMT; Features: Moisture Resistant; Series: RC; Number of Terminations: 2; Resistance Tolerance: 1%; Technology: THICK FILM; Construction: Rectangular; Length: 1mm; Width: 0.5mm; Height: 0.32mm; Depth: 0.5mm; RoHS Compliant: Yes; Reach SVHC Compliant: Yes; Military Standard: Not; Lead Free: Lead Free; ComponentLink1URL: https://datasheet.ciiva.com/11819/0900766b80c66297-11819462.pdf?src-supplier=RSComponents; ComponentLink1Description: https://datasheet.ciiva.com/11819/0900766b80c66297-11819462.pdf?src-supplier=RSComponents; ComponentLink2URL: https://datasheet.ciiva.com/7849/1018594-7849912.pdf?src-supplier=Element14; ComponentLink2Description: https://datasheet.ciiva.com/7849/1018594-7849912.pdf?src-supplier=Element14; ComponentLink3URL: https://datasheet.ciiva.com/7849/1018594-7849911.pdf?src-supplier=Element14; ComponentLink3Description: https://datasheet.ciiva.com/7849/1018594-7849911.pdf?src-supplier=Element14; ComponentLink4URL: https://datasheet.ciiva.com/16930/pyu-rc0402-51-rohs-l-6-r-16930687.pdf?src-supplier=Future+Electronics; ComponentLink4Description: https://datasheet.ciiva.com/16930/pyu-rc0402-51-rohs-l-6-r-16930687.pdf?src-supplier=Future+Electronics; ComponentLink5URL: https://datasheet.ciiva.com/26829/getdatasheetpartid-554995-26829991.pdf?src-supplier=Verical; ComponentLink5Description: https://datasheet.ciiva.com/26829/getdatasheetpartid-554995-26829991.pdf?src-supplier=Verical; Supplier Part Number 1: RC0402FR-0722RL; LCSC Part Number: C114765
R150 = RC0402FR-07100RL: RES 100 OHM 1% 1/16W 0402; Manufacturer: Yageo; Power Rating: 62.5mW; Voltage Rating: 50V; Temperature Coefficient: 100ppm/°C; Max Power Dissipation: 63mW; Item Type: Resistor; Supplier 1: Mouser; Manufacturer Part Number: RC0402FR-07100RL; RoHS: Yes; Category: Chip SMD Resistors; Stock 1: 699545; Pricing 1: 1=0.10000, 10=0.01200, 50=0.01200, 100=0.00500, 1000=0.00300, 2500=0.00200, 10000=0.00100 (USD); Case/Package: 0402; Number of Pins: 2; Case Code (Imperial): 0402; Case Code (Metric): 1005; Size Code: 0402; Min Operating Temperature: -55°C; Max Operating Temperature: 155°C; Tolerance: 1%; Voltage Rating (DC): 50V; Resistance: 100R; Packaging: Tape and Reel; Termination: SMD/SMT; Resistor Type: Thick Film; Features: Moisture Resistant; Series: RC; Number of Terminations: 2; Resistance Tolerance: 1%; Construction: Rectangular; Technology: THICK FILM; Length: 1mm; Width: 0.5mm; Height: 0.32mm; Depth: 0.5mm; RoHS Compliant: Yes; REACH SVHC: No SVHC; Military Standard: Not; Lead Free: Lead Free; ComponentLink1URL: https://datasheet.ciiva.com/11808/0900766b80c66297-11808765.pdf?src-supplier=RSComponents; ComponentLink1Description: https://datasheet.ciiva.com/11808/0900766b80c66297-11808765.pdf?src-supplier=RSComponents; ComponentLink2URL: https://datasheet.ciiva.com/7849/1784430-7849810.pdf?src-supplier=Element14; ComponentLink2Description: https://datasheet.ciiva.com/7849/1784430-7849810.pdf?src-supplier=Element14; ComponentLink3URL: https://datasheet.ciiva.com/28367/1018594-28367226.pdf?src-supplier=Element14; ComponentLink3Description: https://datasheet.ciiva.com/28367/1018594-28367226.pdf?src-supplier=Element14; ComponentLink4URL: https://datasheet.ciiva.com/22747/1018594-22747511.pdf?src-supplier=Element14; ComponentLink4Description: https://datasheet.ciiva.com/22747/1018594-22747511.pdf?src-supplier=Element14; ComponentLink5URL: https://datasheet.ciiva.com/12667/pyu-rc0402-51-rohs-l-6-r-12667957.pdf?src-supplier=Mouser; ComponentLink5Description: https://datasheet.ciiva.com/12667/pyu-rc0402-51-rohs-l-6-r-12667957.pdf?src-supplier=Mouser; ComponentLink6URL: https://datasheet.ciiva.com/15189/getdatasheetpartid-329466-15189335.pdf?src-supplier=Verical; ComponentLink6Description: https://datasheet.ciiva.com/15189/getdatasheetpartid-329466-15189335.pdf?src-supplier=Verical; ComponentLink7URL: https://datasheet.ciiva.com/16740/pyu-rc0402-51-rohs-l-6-r-16740566.pdf?src-supplier=Future+Electronics; ComponentLink7Description: https://datasheet.ciiva.com/16740/pyu-rc0402-51-rohs-l-6-r-16740566.pdf?src-supplier=Future+Electronics; Supplier Part Number 1: 603-RC0402FR-07100RL; LCSC Part Number: C106232
R151 = RC0402FR-07120RL: RES 120 OHM 1% 1/16W 0402; Manufacturer: Yageo; Temperature Coefficient: 100ppm/°C; Power Rating: 62.5mW; Voltage Rating: 50V; Max Power Dissipation: 63mW; Item Type: Resistors; Manufacturer Part Number: RC0402FR-07120RL; RoHS: Yes; Case/Package: 0402; Case Code (Metric): 1005; Case Code (Imperial): 0402; Min Operating Temperature: -55°C; Max Operating Temperature: 155°C; Tolerance: 1%; Resistor Type: Thick Film; Packaging: Tape and Reel; Package Quantity: 1; Number of Terminations: 2; Termination: SMD/SMT; Features: Moisture Resistant; Series: RC; Construction: Rectangular; Resistance Tolerance: 1%; Length: 0.039inch; Width: 0.02inch; Height: 0.016inch; Depth: 0.5mm; Lead Free: 5697LeadFree; Military Standard: Not; RoHS Compliant: Yes; ComponentLink1URL: https://datasheet.ciiva.com/12667/pyu-rc0402-51-rohs-l-6-r-12667958.pdf?src-supplier=Mouser; ComponentLink1Description: https://datasheet.ciiva.com/12667/pyu-rc0402-51-rohs-l-6-r-12667958.pdf?src-supplier=Mouser; ComponentLink2URL: https://datasheet.ciiva.com/7849/1018594-7849831.pdf?src-supplier=Element14; ComponentLink2Description: https://datasheet.ciiva.com/7849/1018594-7849831.pdf?src-supplier=Element14; LCSC Part Number: C114758; Supplier: Future Electronics; Supplier Part Number: 4529079; Stock: 150000; Pricing: 10000=0.0012, 100000=0.0011, 300000=0.001, 750000=0.001, 2000000=0.0009 (USD); Value: 120R; Technology: THICK FILM; Voltage Rating (AC): 50V; Reach SVHC Compliant: No
R152 = RC0402FR-0710KL: RES 10K OHM 1% 1/16W 0402; Manufacturer: Yageo; Max Power Dissipation: 63mW; Temperature Coefficient: 100ppm/°C; Resistance: 10kR; Voltage Rating (DC): 50V; Power Rating: 62.5mW; Item Type: Resistor; Manufacturer Part Number: RC0402FR-0710KL; RoHS: Yes; Category: Chip SMD Resistors; Case/Package: 0402; Case Code (Imperial): 0402; Case Code (Metric): 1005; Min Operating Temperature: -55°C; Max Operating Temperature: 155°C; Features: Moisture Resistant; Packaging: Tape and Reel; Tolerance: 1%; Number of Terminations: 2; Series: RC; RoHS Compliant: Yes; ComponentLink1URL: https://datasheet.ciiva.com/7660/38568-7660787.pdf?src-supplier=Element14; ComponentLink1Description: https://datasheet.ciiva.com/7660/38568-7660787.pdf?src-supplier=Element14; Supplier 1: Mouser; Stock 1: 18648329; Pricing 1: 1=0.10000, 10=0.01400, 50=0.01400, 100=0.00500, 1000=0.00300, 10000=0.00200 (USD); Number of Pins: 2; Resistor Type: Thick Film; Voltage Rating: 50V; Termination: SMD/SMT; Resistance Tolerance: 1%; Construction: Rectangular; Length: 1mm; Width: 0.5mm; Height: 0.32mm; Depth: 0.5mm; Lead Pitch: 0.2mm; REACH SVHC: No SVHC; Lead Free: Lead Free; Military Standard: Not; ComponentLink2URL: https://datasheet.ciiva.com/7849/1686128-7849814.pdf?src-supplier=Element14; ComponentLink2Description: https://datasheet.ciiva.com/7849/1686128-7849814.pdf?src-supplier=Element14; ComponentLink3URL: https://datasheet.ciiva.com/7983/1018594-7983486.pdf?src-supplier=Element14; ComponentLink3Description: https://datasheet.ciiva.com/7983/1018594-7983486.pdf?src-supplier=Element14; ComponentLink4URL: https://datasheet.ciiva.com/22747/1018594-22747512.pdf?src-supplier=Element14; ComponentLink4Description: https://datasheet.ciiva.com/22747/1018594-22747512.pdf?src-supplier=Element14; ComponentLink5URL: https://datasheet.ciiva.com/12667/pyu-rc0402-51-rohs-l-6-r-12667067.pdf?src-supplier=Mouser; ComponentLink5Description: https://datasheet.ciiva.com/12667/pyu-rc0402-51-rohs-l-6-r-12667067.pdf?src-supplier=Mouser; ComponentLink6URL: https://datasheet.ciiva.com/7849/1784430-7849813.pdf?src-supplier=Element14; ComponentLink6Description: https://datasheet.ciiva.com/7849/1784430-7849813.pdf?src-supplier=Element14; Supplier Part Number 1: 603-RC0402FR-0710KL; LCSC Part Number: C60490; Working Voltage: 50V; ComponentLink7URL: https://datasheet.ciiva.com/7849/1784430-7849815.pdf?src-supplier=Element14; ComponentLink7Description: https://datasheet.ciiva.com/7849/1784430-7849815.pdf?src-supplier=Element14
R153 = RCS04021K80FKED: RES SMD 1.8K OHM 1% 1/5W 0402; Manufacturer: Vishay Dale; Resistance: 1.8kR; Max Power Dissipation: 200mW; Temperature Coefficient: 100ppm/°C; Supplier 1: Digi-Key; Manufacturer Part Number: RCS04021K80FKED; Stock 1: 1940; Pricing 1: 1=0.12, 10=0.105, 100=0.0402, 1000=0.01771, 2500=0.0153, 5000=0.01368 (USD); Case/Package: 0402; Min Operating Temperature: -55°C; Max Operating Temperature: 155°C; Package Quantity: 10000; Packaging: Tape and Reel; Resistor Type: Thick Film; Number of Terminations: 2; Tolerance: 1%; Features: Automotive AEC-Q200; Length: 0.039inch; Width: 0.02inch; Height: 0.016inch; ComponentLink1URL: http://www.vishay.com/docs/20065/rcse3.pdf?src-supplier=Digi-Key; ComponentLink1Description: http://www.vishay.com/docs/20065/rcse3.pdf?src-supplier=Digi-Key; Supplier Part Number 1: 541-RCS04021K80FKEDDKR-ND; LCSC Part Number: C1881088
R156 R160 R161 R163-R172 = RC0402FR-074K7L: as R97-R101 on sheet ETHERNET_PHY0; Supplier 1: Avnet; Manufacturer Part Number: RC0402FR-074K7L; RoHS: Yes; Category: Chip SMD Resistors; Stock 1: 2420000; Pricing 1: 10000=0.00085 (USD); Case/Package: 0402; Number of Pins: 2; Case Code (Imperial): 0402; Case Code (Metric): 1005; Size Code: 0402; Min Operating Temperature: -55°C; Max Operating Temperature: 155°C; Tolerance: 1%; Voltage Rating: 50V; Packaging: Tape and Reel; Resistor Type: Thick Film; Termination: SMD/SMT; Features: Moisture Resistant; Series: RC; Number of Terminations: 2; Resistance Tolerance: 1%; Construction: Rectangular; Length: 1mm; Width: 0.5mm; Height: 0.32mm; Depth: 0.5mm; Height - Seated (Max): 0.016inch; RoHS Compliant: Yes; Reach SVHC Compliant: Yes; Military Standard: Not; Lead Free: Lead Free; ComponentLink1URL: https://datasheet.ciiva.com/22661/1686128-22661342.pdf?src-supplier=Element14; ComponentLink1Description: https://datasheet.ciiva.com/22661/1686128-22661342.pdf?src-supplier=Element14; ComponentLink2URL: https://datasheet.ciiva.com/7850/1018594-7850022.pdf?src-supplier=Element14; ComponentLink2Description: https://datasheet.ciiva.com/7850/1018594-7850022.pdf?src-supplier=Element14; ComponentLink3URL: https://datasheet.ciiva.com/7850/1018594-7850023.pdf?src-supplier=Element14; ComponentLink3Description: https://datasheet.ciiva.com/7850/1018594-7850023.pdf?src-supplier=Element14; ComponentLink4URL: https://datasheet.ciiva.com/15215/getdatasheetpartid-328119-15215035.pdf?src-supplier=Verical; ComponentLink4Description: https://datasheet.ciiva.com/15215/getdatasheetpartid-328119-15215035.pdf?src-supplier=Verical; Supplier Part Number 1: RC0402FR-074K7L; LCSC Part Number: C105871
R157 R162 = RC0603JR-070RL: RES 0 OHM JUMPER 1/10W 0603; Manufacturer: Yageo; Resistance: 0mR; Tolerance: 1%; Power Rating: 100mW; Voltage Rating (DC): 50V; Temperature Coefficient: 200ppm/°C; Resistance Tolerance: 5%; Item Type: Resistor; Supplier 1: Digi-Key; Manufacturer Part Number: RC0603JR-070RL; RoHS: Yes; Category: Chip SMD Resistors; Stock 1: 18081776; Pricing 1: 1=0.10000, 10=0.01700, 25=0.01240, 50=0.00960, 100=0.00700, 250=0.00536, 500=0.00430, 1000=0.00316 (USD); Case/Package: 0603; Number of Pins: 2; Contact Plating: Tin,Matte; Case Code (Imperial): 0603; Case Code (Metric): 1608; Size Code: 0603; Min Operating Temperature: -55°C; Max Operating Temperature: 155°C; Resistor Type: Thick Film; Packaging: Tape and Reel; Termination: SMD/SMT; Series: RC; Technology: THICK FILM; Package Quantity: 5000; Voltage Rating: 50V; Features: Moisture Resistant; Max Power Dissipation: 100mW; Number of Terminations: 2; Construction: Rectangular; Length: 1.6mm; Width: 0.8mm; Height: 0.45mm; Depth: 0.8mm; Radiation Hardening: No; Reach SVHC Compliant: No SVHC; Lead Free: Lead Free; RoHS Compliant: Yes; Military Standard: Not; Supplier Part Number 1: 311-0.0GRCT-ND; LCSC Part Number: C95177
U25 = RTL8211F-CG: WQFN-40-EP(5x5) Ethernet ICs ROHS; Manufacturer: Realtek Semicon; Item Type: IC; Manufacturer Part Number: RTL8211F-CG; Package: WQFN-40-EP(5x5); LCSC Part Number: C187932; ComponentLink1Description: LCSC; ComponentLink1URL: https://www.lcsc.com/product-detail/Ethernet-ICs_Realtek-Semicon-RTL8211F-CG_C187932.html
X3 = Q22FA12800090: CRYSTAL 25.0000MHZ 12PF SMD; Manufacturer: Seiko Epson; ComponentLink1Description: LCSC; ComponentLink1URL: https://www.lcsc.com/product-detail/Crystals_Seiko-Epson-Q22FA12800090_C255883.html; Manufacturer Part Number: Q22FA12800090; Package: SMD2016-4P; LCSC Part Number: C255883; Item Type: Crystal